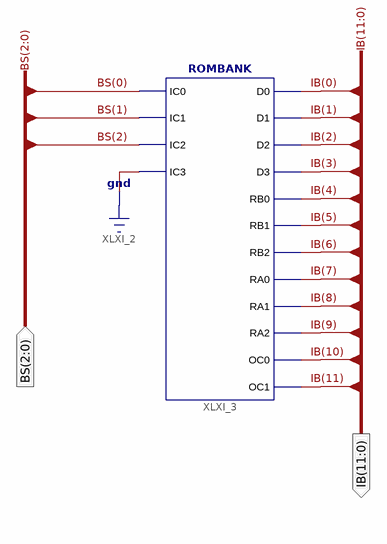
[diagram p0: schematic sheet 1]
// Xilinx ISE schematic ROM.sch (spartan3e) as structural Verilog: 1 symbols, 2 ports
module ROM (
  input  [2:0] BS,
  output [11:0] IB
);

  ROMBANK XLXI_3 (
    .D0(IB[0]), .D1(IB[1]), .D2(IB[2]), .D3(IB[3]), .IC0(BS[0]), .IC1(BS[1]), .IC2(BS[2]), .IC3(1'b0),
    .OC0(IB[10]), .OC1(IB[11]), .RA0(IB[7]), .RA1(IB[8]), .RA2(IB[9]), .RB0(IB[4]), .RB1(IB[5]), .RB2(IB[6]));
endmodule
